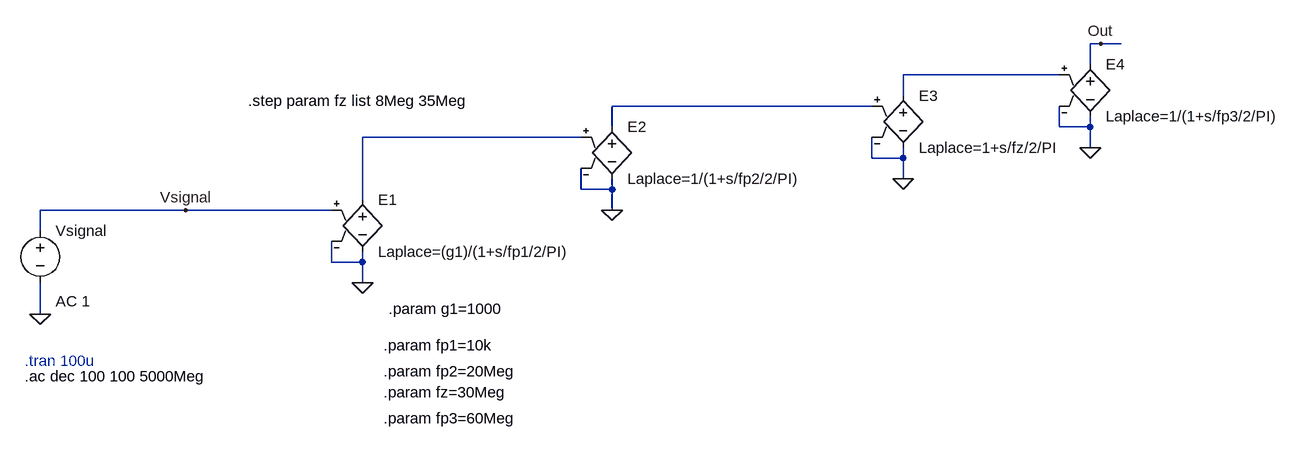
[diagram p0: schematic model_LoopGain.asc]
model_LoopGain.asc, the LTspice schematic file:
Version 4
SHEET 1 3960 1736
WIRE 3408 64 3392 64
WIRE 3440 64 3408 64
WIRE 3392 96 3392 64
WIRE 3344 112 3104 112
WIRE 3104 144 3104 112
WIRE 3056 160 2656 160
WIRE 2656 192 2656 160
WIRE 3344 192 3344 160
WIRE 3392 192 3392 176
WIRE 3392 192 3344 192
WIRE 2608 208 2272 208
WIRE 3392 224 3392 192
WIRE 3056 240 3056 208
WIRE 3104 240 3104 224
WIRE 3104 240 3056 240
WIRE 3104 272 3104 240
WIRE 2608 288 2608 256
WIRE 2656 288 2656 272
WIRE 2656 288 2608 288
WIRE 2272 304 2272 208
WIRE 2000 320 1776 320
WIRE 2224 320 2000 320
WIRE 2656 320 2656 288
WIRE 1776 352 1776 320
WIRE 2224 400 2224 368
WIRE 2272 400 2272 384
WIRE 2272 400 2224 400
WIRE 2272 432 2272 400
WIRE 1776 480 1776 432
FLAG 1776 480 0
FLAG 2000 320 Vsignal
FLAG 2272 432 0
FLAG 2656 320 0
FLAG 3104 272 0
FLAG 3392 224 0
FLAG 3408 64 Out
SYMBOL voltage 1776 336 R0
WINDOW 123 24 124 Left 2
WINDOW 39 0 0 Left 0
WINDOW 3 -141 54 Left 2
SYMATTR Value2 AC 1
SYMATTR Value ""
SYMATTR InstName Vsignal
SYMBOL e 2272 288 R0
SYMATTR InstName E1
SYMATTR Value Laplace=(g1)/(1+s/fp1/2/PI)
SYMBOL e 2656 176 R0
SYMATTR InstName E2
SYMATTR Value Laplace=1/(1+s/fp2/2/PI)
SYMBOL e 3104 128 R0
SYMATTR InstName E3
SYMATTR Value Laplace=1+s/fz/2/PI
SYMBOL e 3392 80 R0
SYMATTR InstName E4
SYMATTR Value Laplace=1/(1+s/fp3/2/PI)
TEXT 1752 576 Left 2 !.ac dec 100 100 5000Meg
TEXT 1752 552 Left 2 ;.tran 100u
TEXT 2096 152 Left 2 !.step param fz list 8Meg 35Meg
TEXT 2312 472 Left 2 !.param g1=1000
TEXT 2304 528 Left 2 !.param fp1=10k
TEXT 2304 568 Left 2 !.param fp2=20Meg
TEXT 2304 600 Left 2 !.param fz=30Meg
TEXT 2304 640 Left 2 !.param fp3=60Meg

The netlist it stands for:
* model_LoopGain.asc
Vsignal Vsignal 0 AC 1
E1 N003 0 Vsignal 0 Laplace=(g1)/(1+s/fp1/2/PI)
E2 N002 0 N003 0 Laplace=1/(1+s/fp2/2/PI)
E3 N001 0 N002 0 Laplace=1+s/fz/2/PI
E4 Out 0 N001 0 Laplace=1/(1+s/fp3/2/PI)
.ac dec 100 100 5000Meg
* .tran 100u
.step param fz list 8Meg 35Meg
.param g1=1000
.param fp1=10k
.param fp2=20Meg
.param fz=30Meg
.param fp3=60Meg
.backanno
.end